# EAGLE design IUWASH_BOX (EAGLE 6.5.0)
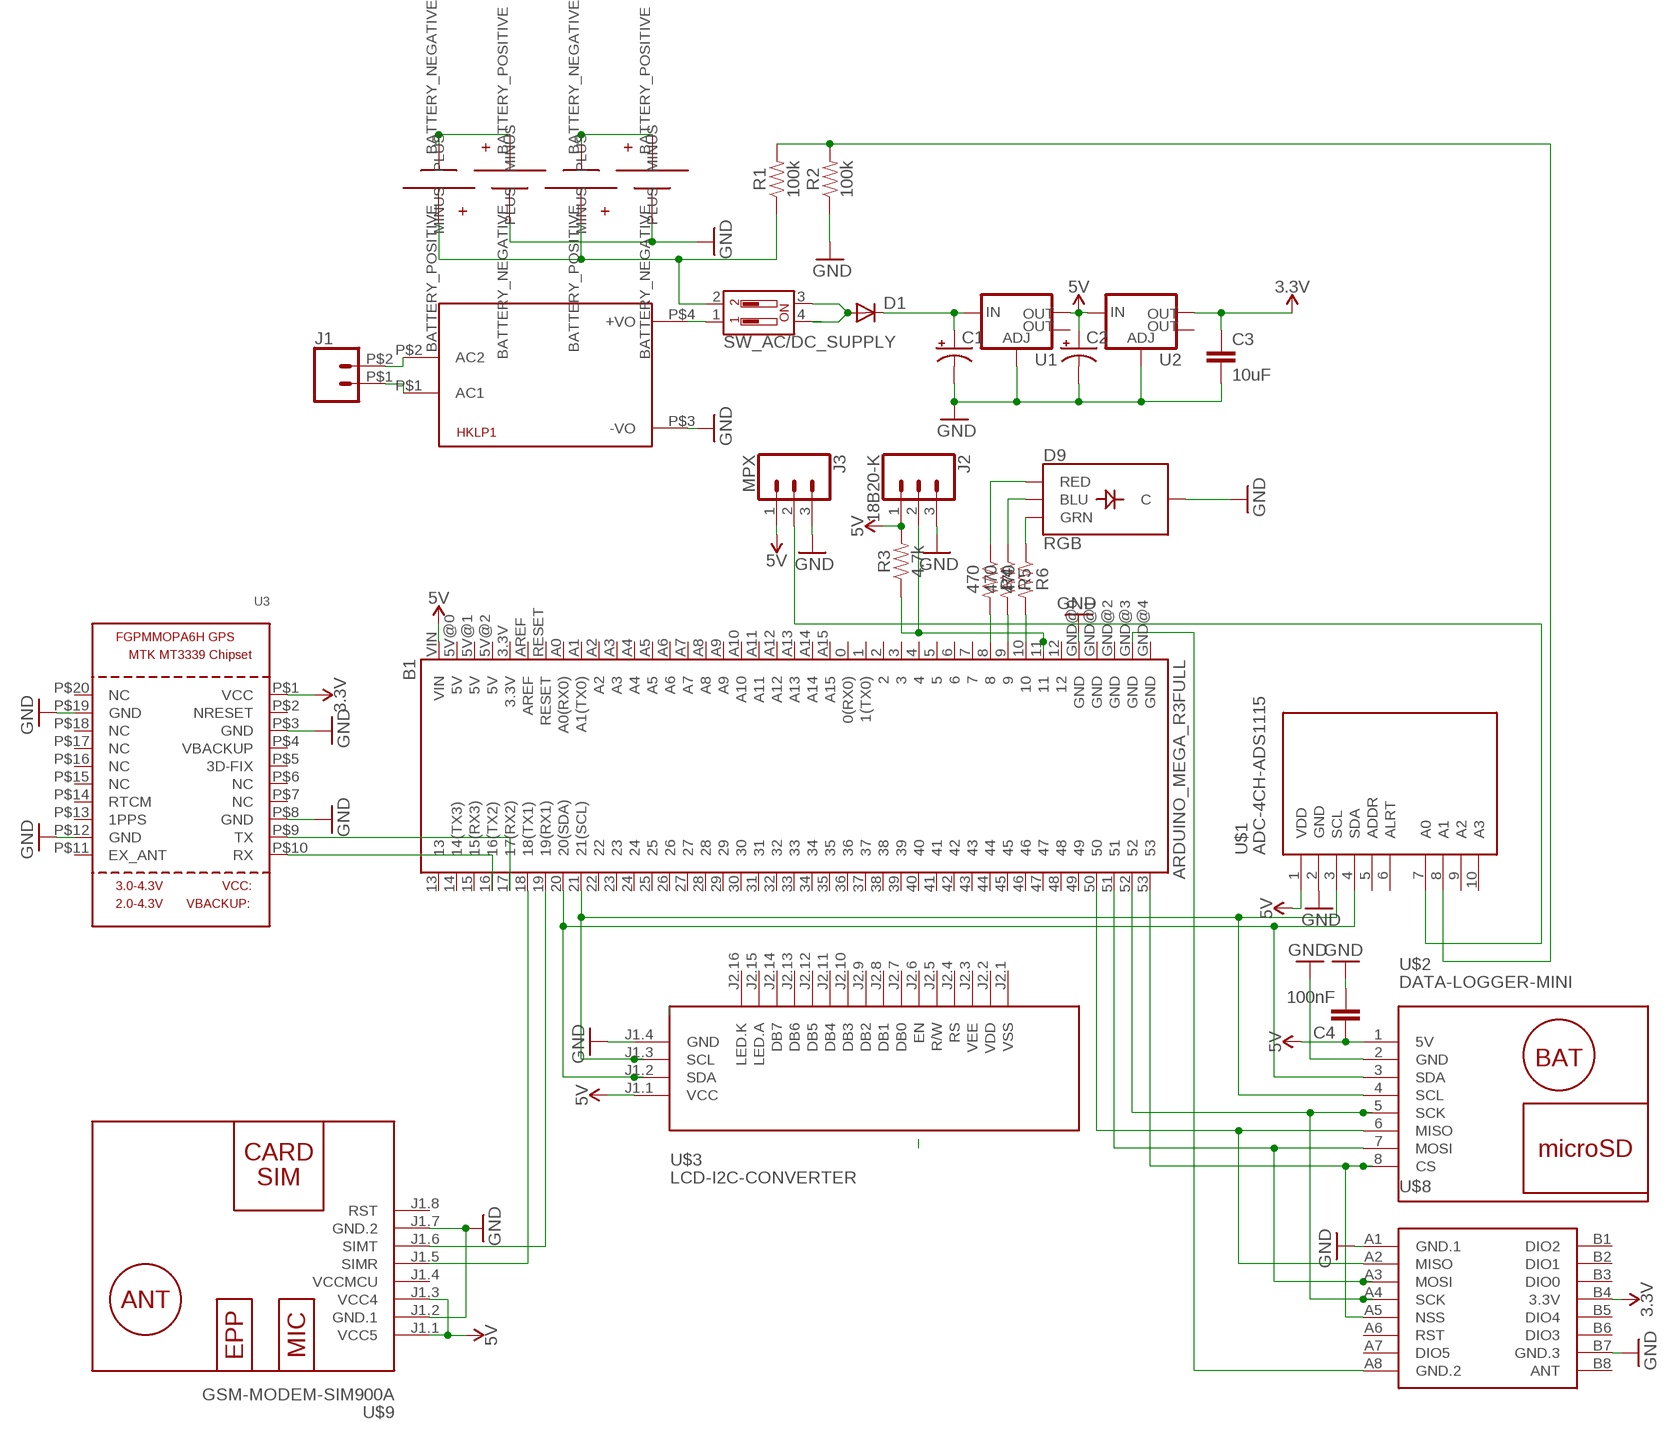
[diagram p0: schematic, sheet 1]

## Parts
B1  ARDUINO_MEGA_R3FULL  [ARDUINO_MEGA]
C1  CPOL-USE  [PANASONIC_E]
C2  CPOL-USE  [PANASONIC_E]
C3  10uF  10UF-0603-6.3V-20%  [0603]
C4  100nF  10UF-0603-6.3V-20%  [0603]
D1  DIODE-SOD106-W  [SOD106-W]
D9  RGB  LED-RGB-CCDIFFUSE  [LED-RGB-THRU]
HKLP1  HKLPM01  [HKLPM01]
J1  CONN_02PTH2  [1X02_BIG]
J2  18B20-K  CONN_03SCREW  [SCREWTERMINAL-3.5MM-3]
J3  MPX  CONN_03SCREW  [SCREWTERMINAL-3.5MM-3]
R1  100k  1KOHM-0603-1/10W-1%  [0603]
R2  100k  1KOHM-0603-1/10W-1%  [0603]
R3  4.7k  4.7KOHM-0603-1/10W-1%  [0603]
R4  470  1KOHM-0603-1/10W-1%  [0603]
R5  470  1KOHM-0603-1/10W-1%  [0603]
R6  470  1KOHM-0603-1/10W-1%  [0603]
SW_AC/DC_SUPPLY  DIP-02-PTH-100MIL  [DIPSWITCH-02-209-2LPST]
U1  V_REG_LM1117SOT223  [SOT223]
U2  V_REG_LM1117SOT223  [SOT223]
U3  GPS_FGPMMOPA6H  [FGPMMOPA6H]
U$1  ADC-4CH-ADS1115  [ADC-4CH-ADS1115]
U$2  DATA-LOGGER-MINI  [DATA-LOGGER-MINI]
U$3  LCD-I2C-CONVERTER  [LCD-I2C-CONVERTER]
U$4  SMT18650  [18650SMT]
U$5  SMT18650  [18650SMT]
U$6  SMT18650  [18650SMT]
U$7  SMT18650  [18650SMT]
U$8  WIRELESS-LORA-RFM95W#SMD  [WIRELESS-LORA-RFM95W#SMD]
U$9  GSM-MODEM-SIM900A  [GSM-MODEM-SIM900A]

## Nets
3.3V: C3.1 U2.2(OUT) U3.P$1(VCC) U$8.B4(3.3V)
5V: B1.VIN C2.+ C4.1 J2.1 J3.1 R3.2 U1.2(OUT) U2.3(IN) U$1.1(VDD) U$2.1(5V) U$3.J1.1(VCC) U$9.J1.1(VCC5) U$9.J1.3(VCC4)
GND: C4.2 HKLP1.P$3(-VO) J3.3 R2.1 U3.P$3(GND) U3.P$8(GND) U3.P$12(GND) U3.P$19(GND) U$2.2(GND) U$3.J1.4(GND) U$5.BATTERY_NEGATIVE(MINUS) U$7.BATTERY_NEGATIVE(MINUS) U$8.A1(GND.1) U$8.B7(GND.3) U$9.J1.2(GND.1) U$9.J1.7(GND.2)
N$1: C1.+ D1.C U1.3(IN)
N$2: B1.50 U$2.6(MISO) U$8.A2(MISO)
N$3: D1.A SW_AC/DC_SUPPLY.3 SW_AC/DC_SUPPLY.4
N$4: HKLP1.P$4(+VO) SW_AC/DC_SUPPLY.1
N$5: HKLP1.P$1(AC1) J1.P$1
N$6: HKLP1.P$2(AC2) J1.P$2
N$7: D9.3(GRN) R6.1
N$8: J3.2 U$1.7(A0)
N$9: R1.1 SW_AC/DC_SUPPLY.2 U$4.BATTERY_POSITIVE(PLUS) U$6.BATTERY_POSITIVE(PLUS)
N$10: U$4.BATTERY_NEGATIVE(MINUS) U$5.BATTERY_POSITIVE(PLUS)
N$11: U$6.BATTERY_NEGATIVE(MINUS) U$7.BATTERY_POSITIVE(PLUS)
N$12: R1.2 R2.2 U$1.8(A1)
N$13: B1.17(17(RX2)) U3.P$9(TX)
N$15: B1.52 U$2.5(SCK) U$8.A4(SCK)
N$16: B1.51 U$2.7(MOSI) U$8.A3(MOSI)
N$17: B1.16(16(TX2)) U3.P$10(RX)
N$18: B1.GND@3(GND) U$8.A8(GND.2)
N$19: B1.19(19(RX1)) U$9.J1.6(SIMT)
N$20: B1.20(20(SDA)) U$1.4(SDA) U$2.3(SDA) U$3.J1.2(SDA)
N$21: B1.21(21(SCL)) U$1.3(SCL) U$2.4(SCL) U$3.J1.3(SCL)
N$22: B1.53 U$2.8(CS) U$8.A5(NSS)
N$23: B1.18(18(TX1)) U$9.J1.5(SIMR)
N$31: B1.8 R4.2
N$32: B1.11 J2.2 R3.1
N$33: B1.9 R5.2
N$34: D9.4(BLU) R5.1
N$35: D9.1(RED) R4.1
N$36: B1.10 R6.2
N$56: B1.GND@0(GND) C1.- C2.- C3.2 D9.2(C) J2.3 U1.1(ADJ) U2.1(ADJ) U$1.2(GND) ; supply symbol labelled GND
Unconnected: B1.0(0(RX0)) B1.1(1(TX0)) B1.2 B1.3 B1.3.3V B1.4 B1.5 B1.5V@0(5V) B1.5V@1(5V) B1.5V@2(5V) B1.6 B1.7 B1.12 B1.13 B1.14(14(TX3)) B1.15(15(RX3)) B1.22 B1.23 B1.24 B1.25 B1.26 B1.27 B1.28 B1.29 B1.30 B1.31 B1.32 B1.33 B1.34 B1.35 B1.36 B1.37 B1.38 B1.39 B1.40 B1.41 B1.42 B1.43 B1.44 B1.45 B1.46 B1.47 B1.48 B1.49 B1.A0(A0(RX0)) B1.A1(A1(TX0)) B1.A2 B1.A3 B1.A4 B1.A5 B1.A6 B1.A7 B1.A8 B1.A9 B1.A10 B1.A11 B1.A12 B1.A13 B1.A14 B1.A15 B1.AREF B1.GND@1(GND) B1.GND@2(GND) B1.GND@4(GND) B1.RESET U1.4(OUT) U2.4(OUT) U3.P$2(NRESET) U3.P$4(VBACKUP) U3.P$5(3D-FIX) U3.P$6(NC) U3.P$7(NC) U3.P$11(EX_ANT) U3.P$13(1PPS) U3.P$14(RTCM) U3.P$15(NC) U3.P$16(NC) U3.P$17(NC) U3.P$18(NC) U3.P$20(NC) U$1.5(ADDR) U$1.6(ALRT) U$1.9(A2) U$1.10(A3) U$3.J2.1(VSS) U$3.J2.2(VDD) U$3.J2.3(VEE) U$3.J2.4(RS) U$3.J2.5(R/W) U$3.J2.6(EN) U$3.J2.7(DB0) U$3.J2.8(DB1) U$3.J2.9(DB2) U$3.J2.10(DB3) U$3.J2.11(DB4) U$3.J2.12(DB5) U$3.J2.13(DB6) U$3.J2.14(DB7) U$3.J2.15(LED.A) U$3.J2.16(LED.K) U$8.A6(RST) U$8.A7(DIO5) U$8.B1(DIO2) U$8.B2(DIO1) U$8.B3(DIO0) U$8.B5(DIO4) U$8.B6(DIO3) U$8.B8(ANT) U$9.J1.8(RST)

## Power pins joined to a net without a drawn wire
VCCMCU: U$9.J1.4(VCCMCU)

## Library data of the parts
B1 = SparkFun-Boards:ARDUINO_MEGA_R3: Arduino Mega R3 ATmega2560 R3 compatible footprint. SparkFun Products: Arduino Mega 2560 R3 <https://www.sparkfun.com/products/11061>
C1 C2 = adafruit:CPOL-US: POLARIZED CAPACITOR, American symbol
C3 = SparkFun-Capacitors:10UF: 10.0µF ceramic capacitors A capacitor is a passive two-terminal electrical component used to store electrical energy temporarily in an electric field.; PROD_ID: CAP-11015
C4 = SparkFun-Capacitors:10UF: 10.0µF ceramic capacitors A capacitor is a passive two-terminal electrical component used to store electrical energy temporarily in an electric field.; PROD_ID: CAP-11015; VALUE: 10uF
D1 = diode:DIODE-: DIODE
D9 = SparkFun-LED:LED-RGB-CC: LED-RGB Common Cathode Packages: LED RGB-THRU LED_PIRANHA_5MM SparkFun Products: RGB Diffused Common Cathode- Diffuse <[https://www.sparkfun.com/products/9264]> RGB Diffused Common Cathode - Clear <[https://www.sparkfun.com/products/105]> LED-RGB 5mm Square (Piranha) <[https://www.sparkfun.com/products/11679]>; PROD_ID: DIO-09434; VALUE: DIFFUSE
HKLP1 = HLKPM01EaglesLib:HKLPM01
J1 = SparkFun-Connectors:CONN_02: Multi connection point. Often used as Generic Header-pin footprint for 0.1 inch spaced/style header connections On any of the 0.1 inch spaced packages, you can populate with these: Break Away Headers - Straight <https://www.sparkfun.com/products/116> (PRT-00116) Break Away Male Headers - Right Angle <https://www.sparkfun.com/products/553> (PRT-00553) Female Headers <https://www.sparkfun.com/products/115> (PRT-00115) Break Away Headers - Machine Pin <https://www.sparkfun.com/products/117> (PRT-00117) Break Away Female Headers - Swiss Machine Pin <https://www.sparkfun.com/products/743> (PRT-00743) For SCREWTERMINALS and SPRING TERMINALS visit here: Screw Terimnals on SparkFun.com <https://www.sparkfun.com/search/results?term=Screw+Terminals> (5mm/3.5mm/2.54mm spacing) This device is also useful as a general connection point to wire up your design to another part of your project. Our various solder wires solder well into these plated through hole pads. Hook-Up Wire - Assortment (Stranded, 22 AWG) <https://www.sparkfun.com/products/11375> (PRT-11375) Hook-Up Wire - Assortment (Solid Core, 22 AWG) <https://www.sparkfun.com/products/11367> (PRT-11367) View the entire wire category on our website here <https://www.sparkfun.com/categories/141> Special notes: Molex polarized connector foot print use with: PRT-08233 with associated crimp pins and housings. 2.54_SCREWTERM for use with PRT-10571. 3.5mm Screw Terminal footprints for PRT-08084 5mm Screw Terminal footprints for use with PRT-08432
J2 J3 = SparkFun-Connectors:CONN_03: Multi connection point. Often used as Generic Header-pin footprint for 0.1 inch spaced/style header connections On any of the 0.1 inch spaced packages, you can populate with these: Break Away Headers - Straight <https://www.sparkfun.com/products/116> (PRT-00116) Break Away Male Headers - Right Angle <https://www.sparkfun.com/products/553> (PRT-00553) Female Headers <https://www.sparkfun.com/products/115> (PRT-00115) Break Away Headers - Machine Pin <https://www.sparkfun.com/products/117> (PRT-00117) Break Away Female Headers - Swiss Machine Pin <https://www.sparkfun.com/products/743> (PRT-00743) Stackable Header - 3 Pin (Female, 0.1") <https://www.sparkfun.com/products/13875> (PRT-13875) For SCREWTERMINALS and SPRING TERMINALS visit here: Screw Terimnals on SparkFun.com <https://www.sparkfun.com/search/results?term=Screw+Terminals> (5mm/3.5mm/2.54mm spacing) This device is also useful as a general connection point to wire up your design to another part of your project. Our various solder wires solder well into these plated through hole pads. Hook-Up Wire - Assortment (Stranded, 22 AWG) <https://www.sparkfun.com/products/11375> (PRT-11375) Hook-Up Wire - Assortment (Solid Core, 22 AWG) <https://www.sparkfun.com/products/11367> (PRT-11367) View the entire wire category on our website here <https://www.sparkfun.com/categories/141> Special notes: Molex polarized connector foot print use with SKU : PRT-08232 with associated crimp pins and housings.; PROD_ID: CONN-08288; SF_ID: PRT-08235
R1 R2 R4-R6 = SparkFun-Resistors:1KOHM: 1kΩ resistor A resistor is a passive two-terminal electrical component that implements electrical resistance as a circuit element. Resistors act to reduce current flow, and, at the same time, act to lower voltage levels within circuits. - Wikipedia; PROD_ID: RES-07856; VALUE: 1k
R3 = SparkFun-Resistors:4.7KOHM: 4.7kΩ resistor A resistor is a passive two-terminal electrical component that implements electrical resistance as a circuit element. Resistors act to reduce current flow, and, at the same time, act to lower voltage levels within circuits. - Wikipedia; PROD_ID: RES-07857
SW_AC/DC_SUPPLY = SparkFun-Switches:DIP-02: 2-Position DIP Switch 2-circuit DIP (dual inline package) switch. Commonly used to physcially set a circuit's behavior. Variants PTH-100MIL - Through-hole, 0.1"-Pitch Used on SparkFun Stepoko <https://www.sparkfun.com/products/13899> (ROB-13899) SMD-50MIL-JWING - SMD (J-Wing Pads), 0.05"-Pitch Prototype Part SMD-50MIL - SMD, 0.05"-Pitch Used on SparkFun Battery Babysitter <https://www.sparkfun.com/products/13777> (PRT-13777); PROD_ID: SWCH-12532
U1 U2 = SparkFun-IC-Power:V_REG_LM1117: Voltage Regulator LM1117 Standard adjustable voltage regulator but in SMD form. Spark Fun Electronics SKU : COM-00595; PROD_ID: VREG-08170
U3 = adafruit:GPS_FGPMMOPA6H: GPS Module - MTK MT3339 Chipset, -165dBm sensitivity, 22 channels, 10Hz, auto-select external antenna options
U$1 = diy-modules:ADC-4CH-ADS1115: 4 Channel 16-Bit Analog-to-Digital Converter based on ADS1115 chip Arduino ADS1115 Getting Started Tutorial is available here: http://henrysbench.capnfatz.com/henrys-bench/arduino-voltage-measurements/arduino-ads1115-module-getting-started-tutorial/ ADS1115 datasheet is available here: http://www.ti.com/lit/ds/symlink/ads1115.pdf Click here to find device on ebay.com <http://www.ebay.com/sch/ads1115+module>
U$2 = diy-modules:DATA-LOGGER-MINI: Mini Data Logger with microSD card and battery powered RTC based on DS1307 chip Arduino library for DS1307 and description are available here: https://www.pjrc.com/teensy/td_libs_DS1307RTC.html Tutorial how to use SD card with Arduino: https://www.arduino.cc/en/reference/SD Click here to find device on ebay.com <http://www.ebay.com/sch/mini+data+logger+arduino>
U$3 = diy-modules:LCD-I2C-CONVERTER: I2C Bus to 4-Bit Parallel LCD Interface with LED backlight driver
U$4-U$7 = SMT18650:SMT18650
U$8 = diy-modules:WIRELESS-LORA-RFM95W: 868/915 MHz LoRa Radio Transceiver Module based on SX1276 chip Click here to find device on ebay.com <http://www.ebay.com/sch/RFM95W+transceiver>
U$9 = diy-modules:GSM-MODEM-SIM900A: GSM Mini Module based on SIM900A Schematic available here: http://www.electrodragon.com/w/SIM900_(SIM900A)_Mini_DEV_Board

## Board
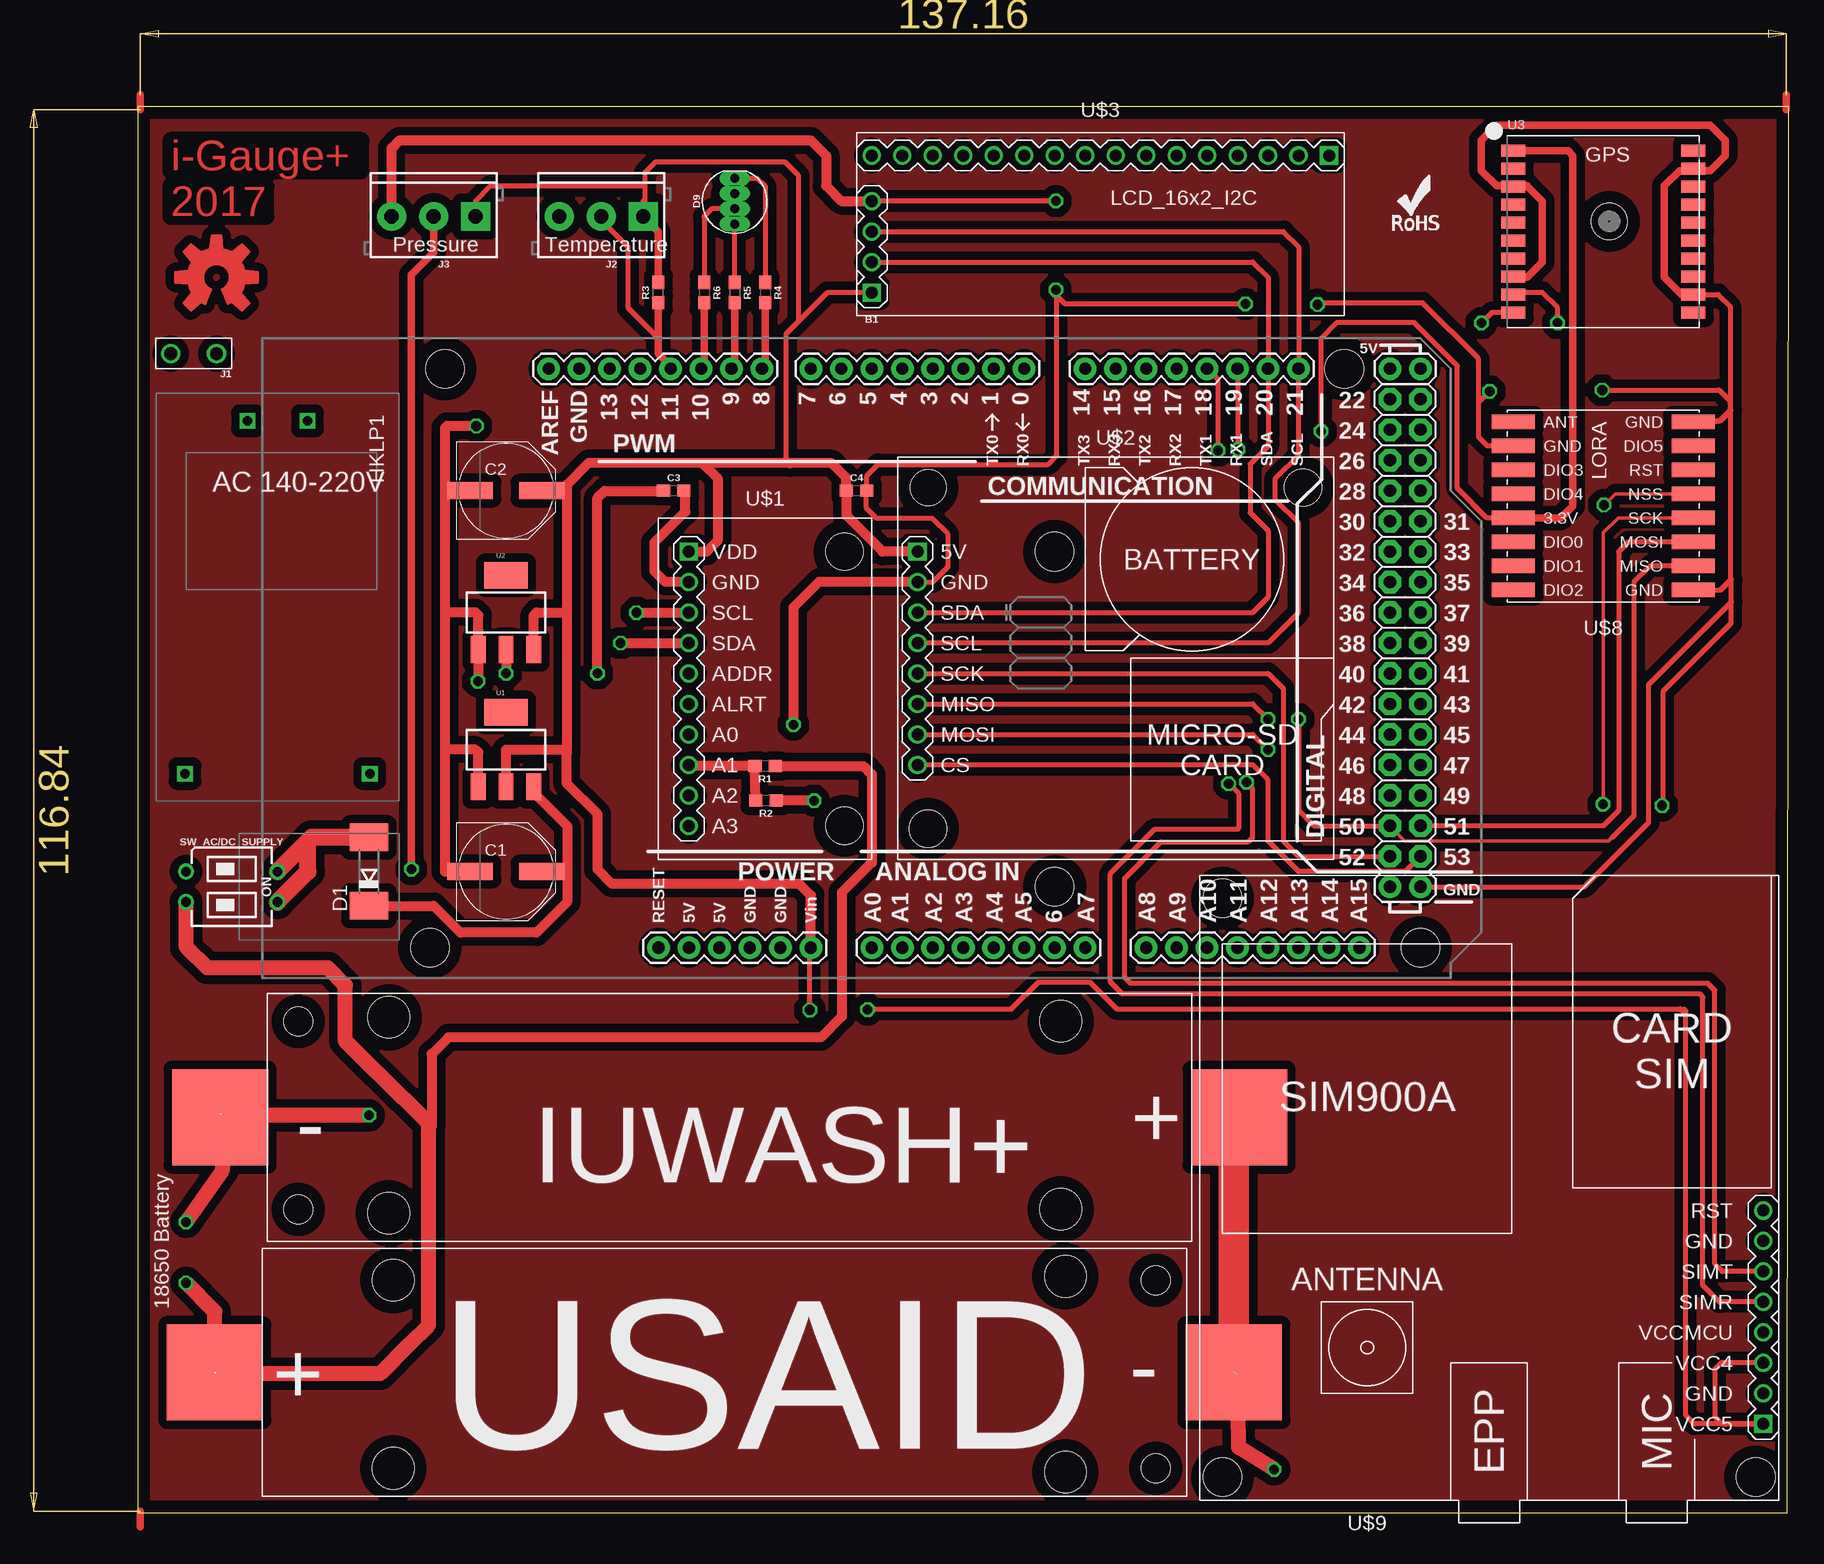
[diagram p1: board, top side]
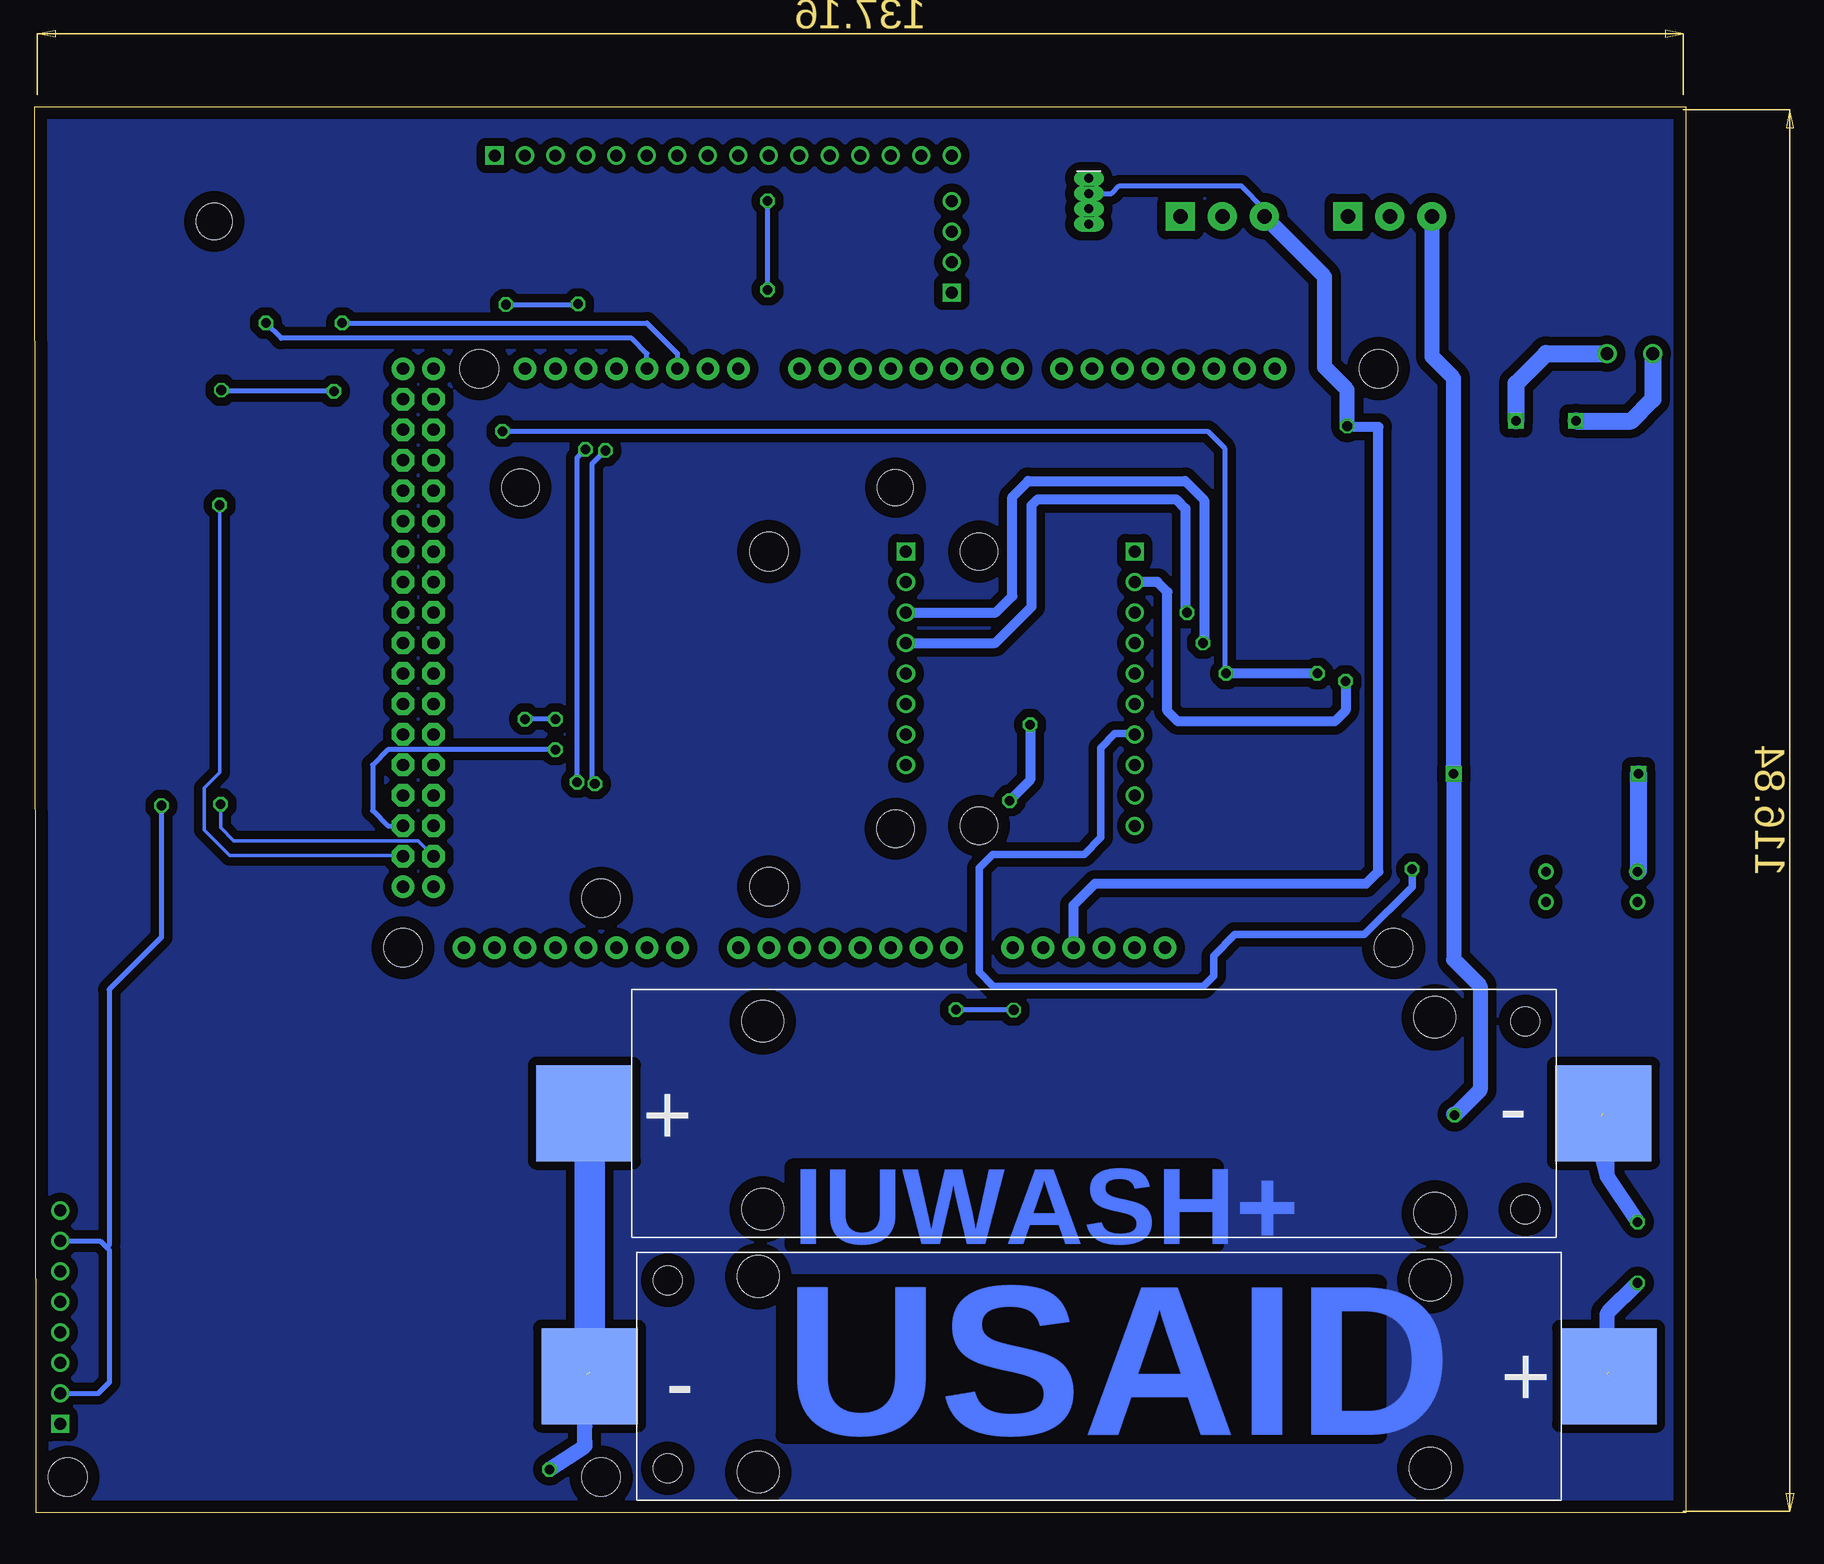
[diagram p2: board, bottom side, seen from below]

Size 137.56 x 117.21 mm. Coordinates in mm from the lower left corner, seen from the top.
Outline: 0,0 137.46,0 137.56,117.21 0,117.21 0,0
Copper layers (1*16): Top 0.035mm / dielectric 1.5mm / Bottom 0.035mm
Design rules "default *": minimum track width 10mil, minimum drill 24mil, track to track 28mil, track to pad 28mil, pad to pad 28mil, via to via 28mil, smd to smd 28mil, copper to edge 40mil, drill to drill 8mil, minimum pad ring 10mil, minimum via ring 8mil, stop-mask expansion 4mil, vias tented up to drill 0mil, thermal gap 10mil

### Footprints (pad centres in the part's own frame; a part is rotated, then mirrored left to right if it is on the bottom)
ARDUINO_MEGA = drill 1.016 pad 1.88: 0 13.97,24.13; 1 11.43,24.13; 2 8.89,24.13; 3 6.35,24.13; 3.3V -13.97,-24.13; 4 3.81,24.13; 5 1.27,24.13; 5V@0 -11.43,-24.13; 5V@1 44.45,24.13; 5V@2 46.99,24.13; 6 -1.27,24.13; 7 -3.81,24.13; 8 -7.874,24.13; 9 -10.414,24.13; 10 -12.954,24.13; 11 -15.494,24.13; 12 -18.034,24.13; 13 -20.574,24.13; 14 19.05,24.13; 15 21.59,24.13; 16 24.13,24.13; 17 26.67,24.13; 18 29.21,24.13; 19 31.75,24.13; 20 34.29,24.13; 21 36.83,24.13; A0 1.27,-24.13; A1 3.81,-24.13; A2 6.35,-24.13; A3 8.89,-24.13; A4 11.43,-24.13; A5 13.97,-24.13; A6 16.51,-24.13; A7 19.05,-24.13; A8 24.13,-24.13; A9 26.67,-24.13; A10 29.21,-24.13; A11 31.75,-24.13; A12 34.29,-24.13; A13 36.83,-24.13; A14 39.37,-24.13; A15 41.91,-24.13; AREF -25.654,24.13; GND@0 -8.89,-24.13; GND@1 -6.35,-24.13; GND@2 44.45,-19.05; GND@3 46.99,-19.05; GND@4 -23.114,24.13; RESET -16.51,-24.13; VIN -3.81,-24.13 | drill 1.016 pad 1.88 octagon: 22 44.45,21.59; 23 46.99,21.59; 24 44.45,19.05; 25 46.99,19.05; 26 44.45,16.51; 27 46.99,16.51; 28 44.45,13.97; 29 46.99,13.97; 30 44.45,11.43; 31 46.99,11.43; 32 44.45,8.89; 33 46.99,8.89; 34 44.45,6.35; 35 46.99,6.35; 36 44.45,3.81; 37 46.99,3.81; 38 44.45,1.27; 39 46.99,1.27; 40 44.45,-1.27; 41 46.99,-1.27; 42 44.45,-3.81; 43 46.99,-3.81; 44 44.45,-6.35; 45 46.99,-6.35; 46 44.45,-8.89; 47 46.99,-8.89; 48 44.45,-11.43; 49 46.99,-11.43; 50 44.45,-13.97; 51 46.99,-13.97; 52 44.45,-16.51; 53 46.99,-16.51 | hole 3.2: -34.29,24.13; -35.56,-24.13; 16.51,8.89; 16.51,-19.05; 40.64,24.13; 46.99,-24.13
PANASONIC_E = smd 3.8 x 1.4: + 3,0; - -3,0
0603 = smd 1.1 x 1: 1 -0.85,0; 2 0.85,0
SOD106-W = smd 2.3 x 3.2: A 2.85,0; C -2.85,0
LED-RGB-THRU = drill 0.762 pad 0.889 long: 1 1.905,0; 2 0.635,0; 3 -0.635,0; 4 -1.905,0
HKLPM01 = drill 0.8 square: P$1 -14.7,2.5; P$2 -14.7,-2.5; P$3 14.7,7.7; P$4 14.7,-7.7
1X02_BIG = drill 1.067: P$1 0,0; P$2 3.81,0
SCREWTERMINAL-3.5MM-3 = drill 1.2 pad 2.413 square: 1 0,0 | drill 1.2 pad 2.413: 2 3.5,0; 3 7,0
DIPSWITCH-02-209-2LPST = drill 0.8: 1 -1.27,-3.81; 2 1.27,-3.81; 3 1.27,3.81; 4 -1.27,3.81
SOT223 = smd 1.219 x 2.235: 1 -2.311,-3.099; 2 0,-3.099; 3 2.311,-3.099 | smd 3.6 x 2.2: 4 0,3.099
FGPMMOPA6H = smd 2 x 1: P$1 -7.5,6.75; P$2 -7.5,5.25; P$3 -7.5,3.75; P$4 -7.5,2.25; P$5 -7.5,0.75; P$6 -7.5,-0.75; P$7 -7.5,-2.25; P$8 -7.5,-3.75; P$9 -7.5,-5.25; P$10 -7.5,-6.75; P$11 7.5,-6.75; P$12 7.5,-5.25; P$13 7.5,-3.75; P$14 7.5,-2.25; P$15 7.5,-0.75; P$16 7.5,0.75; P$17 7.5,2.25; P$18 7.5,3.75; P$19 7.5,5.25; P$20 7.5,6.75 | hole 3: 0.5,0.85
ADC-4CH-ADS1115 = drill 1 square: 1 -6.35,11.43 | drill 1: 2 -6.35,8.89; 3 -6.35,6.35; 4 -6.35,3.81; 5 -6.35,1.27; 6 -6.35,-1.27; 7 -6.35,-3.81; 8 -6.35,-6.35; 9 -6.35,-8.89; 10 -6.35,-11.43 | hole 3.1: 6.604,11.43; 6.604,-11.43
DATA-LOGGER-MINI = drill 1 square: 1 -16.51,8.89 | drill 1: 2 -16.51,6.35; 3 -16.51,3.81; 4 -16.51,1.27; 5 -16.51,-1.27; 6 -16.51,-3.81; 7 -16.51,-6.35; 8 -16.51,-8.89 | hole 3: -15.621,14.224 | hole 3.1: -15.621,-14.224; 15.621,14.224
LCD-I2C-CONVERTER = drill 1 square: J1.1 -19.05,-5.08; J2.1 19.05,6.35 | drill 1: J1.2 -19.05,-2.54; J1.3 -19.05,0; J1.4 -19.05,2.54; J2.2 16.51,6.35; J2.3 13.97,6.35; J2.4 11.43,6.35; J2.5 8.89,6.35; J2.6 6.35,6.35; J2.7 3.81,6.35; J2.8 1.27,6.35; J2.9 -1.27,6.35; J2.10 -3.81,6.35; J2.11 -6.35,6.35; J2.12 -8.89,6.35; J2.13 -11.43,6.35; J2.14 -13.97,6.35; J2.15 -16.51,6.35; J2.16 -19.05,6.35
18650SMT = smd 8 x 8: BATTERY_NEGATIVE 80.98,10.32; BATTERY_POSITIVE -3.95,10.32 | hole 3.45: 66.925,18.325; 10.925,2.325 | hole 2.39: 74.455,2.325
WIRELESS-LORA-RFM95W#SMD = smd 3.6 x 1.2: A1 -7.5,7; A2 -7.5,5; A3 -7.5,3; A4 -7.5,1; A5 -7.5,-1; A6 -7.5,-3; A7 -7.5,-5; A8 -7.5,-7; B1 7.5,7; B2 7.5,5; B3 7.5,3; B4 7.5,1; B5 7.5,-1; B6 7.5,-3; B7 7.5,-5; B8 7.5,-7
GSM-MODEM-SIM900A = drill 1 square: J1.1 -22.86,20.32 | drill 1: J1.2 -22.86,17.78; J1.3 -22.86,15.24; J1.4 -22.86,12.7; J1.5 -22.86,10.16; J1.6 -22.86,7.62; J1.7 -22.86,5.08; J1.8 -22.86,2.54 | hole 3.2: -22.225,24.765; 22.225,24.765; 22.225,-23.495

### Placement (x,y rotation side)
B1  59.89,71.24 0 top
C1  30.68,53.46 0 top
C2  30.68,85.21 0 top
C3  44.65,85.21 0 top
C4  59.89,85.21 0 top
D1  19.25,53.46 90 top
D9  49.73,109.34 90 top
HKLP1  11.63,76.32 270 top
J1  6.55,96.64 180 top
J2  42.11,108.07 180 top
J3  28.14,108.07 180 top
R1  52.28,62.25 180 top
R2  52.34,59.37 180 top
R3  43.38,101.72 90 top
R4  52.27,101.72 270 top
R5  49.73,101.72 270 top
R6  47.19,101.72 270 top
SW_AC/DC_SUPPLY  7.82,52.19 270 top
U1  30.68,63.62 0 top
U2  30.68,75.05 0 top
U3  122.12,106.8 0 top
U$1  52.27,68.7 0 top
U$2  81.48,71.24 0 top
U$3  80.21,106.8 0 top
U$4  10.36,21.71 180 bottom
U$5  87.83,22.98 0 bottom
U$6  10.36,1.39 0 top
U$7  87.83,43.3 180 top
U$8  122.12,83.94 180 top
U$9  112.6,27.74 180 top
U$10  [OSHW-LOGO-L_COPPER]  6.55,102.99 0 top
U$11  [ROHS_LOGO_0.18_IN]  104.34,106.8 0 top
U$12  [ROHS_LOGO_0.18_IN]  104.34,106.8 0 top

### Tracks (layer width: path | path; a pad name or v marks a point on that pad's centre or on a via)
3.3V  (via drill 0.8)
  Top 0.406: U$8.B4 112.42,82.94 109.96,85.41 109.96,95.62 106.37,99.2 99.88,99.2 98.57,97.9 98.57,90.19 v98.6,90.17
  Top 0.61: U3.P$1 119.18,113.55 119.58,113.15 119.58,83.94 118.58,82.94 U$8.B4
  Top 0.813: U2.2 v30.68,69.97 | v38.3,69.97 38.3,84.6 38.89,85.2 43.78,85.2 C3.1
  Bottom 0.406: v98.6,90.17 39.84,90.17 38.42,88.75 38.42,70.09 v38.3,69.97
  Bottom 0.813: v30.68,69.97 v38.3,69.97
5V  (via drill 0.8)
  Top 0.406: J3.1 28.14,109.34 29.41,110.61 42.17,110.61 42.26,110.7 | 42.11,109.34 J2.1 42.26,108.22 42.26,110.7 | 42.26,110.7 42.26,111.74 43.13,112.61 53.94,112.61 55.05,111.5 55.05,99.31 | 55.05,99.31 54.12,98.38 54,98.27 54,87.83 54.33,87.5 | U$3.J1.1 57.46,101.72 55.05,99.31 | U$9.J1.3 131.93,12.5 131.41,11.98 131.41,8 131.99,7.42 U$9.J1.1 129.71,7.42 128.99,8.13 128.99,41.56 | 128.99,41.56 128.99,41.84 128.84,41.99 | v60.81,41.96 60.85,41.99 72.8,41.99 75.05,44.25 79.33,44.25 81.55,42.02 128.53,42.02 128.99,41.56 | v55.99,41.92 55.99,47.02 B1.VIN
  Top 0.61: R3.2 43.38,106.8 J2.1
  Top 0.813: U1.2 30.68,63.62 35.47,63.62 | 35.47,63.62 35.76,63.62 35.76,75.05 | 35.76,75.05 35.76,85.21 | 35.76,85.21 C2.+ | U2.3 32.99,74.82 33.22,75.05 35.76,75.05 | B1.VIN 56.08,51.48 55.11,52.44 39.51,52.44 38.31,53.64 38.31,58.24 35.76,60.79 35.76,63.34 35.47,63.62 | 35.76,85.21 35.76,85.72 37.59,87.55 47,87.55 47.12,87.43 | 47.12,87.43 48.31,86.25 48.31,81.04 47.4,80.13 U$1.1 | U$2.1 62.06,80.13 59.06,83.13 59.06,85.19 C4.1 59.04,86.29 57.83,87.5 54.33,87.5 47.19,87.5 47.12,87.43
  Bottom 0.406: v60.81,41.96 56.02,41.96 v55.99,41.92
GND  (via drill 0.8)  (1 unrouted)
  Top 0.406: U$2.2 66.24,77.59 67.51,78.86 67.51,81.59 66.21,82.89 61.58,82.89 60.7,83.77 60.7,85.18 C4.2 60.74,86.46 61.66,87.39 75.85,87.39 76.58,88.12 76.58,101.46 | 76.58,101.46 76.58,101.88 v76.5,101.96 | v76.5,109.35 U$3.J1.4 | U$8.B7 112.47,88.94 111.73,89.69 111.73,92.58 | 111.73,92.58 v112.65,93.5 | v122.03,93.59 131.77,93.59 132.69,92.67 132.69,92.43 | 132.69,92.43 132.69,92.12 | 132.69,92.12 132.69,91.94 131.73,90.97 129.65,90.97 | U$8.A1 131.91,76.94 | 131.91,76.94 132.74,77.77 132.74,92.08 132.69,92.12 | U3.P$12 131.7,101.55 132.68,100.57 132.68,92.44 132.69,92.43 | 111.73,92.58 111.73,96.22 107.09,100.86 98.45,100.86 v98.31,100.72 | v92.29,100.77 77.27,100.77 76.58,101.46 | 131.91,76.94 131.91,76.97 132.76,77.81 132.76,74.14 127.09,68.47 127.09,59.03 v127.02,58.96
  Top 0.61: U3.P$3 115.83,110.55 | 115.83,110.55 117.04,109.34 117.04,104.26 115.77,102.99 114.68,102.99 U3.P$8 | U3.P$12 128.64,101.55 127.2,102.99 127.2,110.61 128.47,111.88 129.45,111.88 U3.P$19 129.79,111.88 131.01,111.88 132.28,113.15 132.28,114.42 131.01,115.69 113.23,115.69 111.96,114.42 111.96,111.88 113.23,110.61 115.77,110.61 115.83,110.55
  Top 0.813: J3.3 21.14,113.77 21.79,114.42 56.08,114.42 57.35,113.15 57.35,110.61 58.62,109.34 U$3.J1.4 | U$2.2 56.75,77.59 54.62,75.47 v54.62,65.7 | v56.34,59.38 R2.1
  Top 1.27: v19.25,33.14 7.01,33.14 | 7.01,33.14 U$7.BATTERY_NEGATIVE | 7.01,33.14 7.01,28.52 v4.01,24.25
  Bottom 0.406: v76.5,101.96 v76.5,109.35 | v112.65,93.5 121.94,93.5 v122.03,93.59 | v98.31,100.72 92.33,100.72 v92.29,100.77 | U$9.J1.7 132.12,22.66 131.58,22.12 | 131.58,22.12 131.36,21.9 131.36,10.9 132.31,9.94 135.44,9.94 U$9.J1.2 | v127.02,58.96 127.02,47.98 131.38,43.63 131.38,22.33 131.58,22.12
  Bottom 0.813: v54.62,65.7 54.62,61.1 v56.34,59.38
  Bottom 1.27: 19.33,33.22 v19.25,33.14 17.14,35.26 17.14,43.93 19.33,46.12 HKLP1.P$3 19.33,94.57 21.14,96.38 J3.3 | 7.01,33.14 7.01,29.79 6.55,28.06 | v4.01,24.25 6.55,28.06 | 6.55,28.06 6.55,32.68 U$7.BATTERY_NEGATIVE
N$1
  Top 0.813: D1.C 24.64,50.61 26.87,48.38 33.22,48.38 35.76,50.92 35.76,53.46 | U1.3 32.99,60.04 35.76,57.27 35.76,53.46 | C1.+ 35.76,53.46
N$2  (via drill 0.8)
  Top 0.305: 122.87,56.31 122.69,56.13 122.69,56.16 | 122.69,56.21 122.69,56.16 | 122.69,56.16 122.55,56.02 105.59,56.02 B1.50
  Top 0.406: U$2.6 92.91,67.43 v94.18,66.16 | v96.72,66.16 96.72,58.54 97.99,57.27 B1.50 | U$8.A2 126.01,78.94 124.66,77.59 124.66,58.1 122.87,56.31
  Bottom 0.406: v94.18,66.16 v96.72,66.16
N$3
  Top 1.422: D1.A 14.48,56.31 14.17,56 | 14.17,56 SW_AC/DC_SUPPLY.4 | SW_AC/DC_SUPPLY.3 14.17,53.46 14.17,56
N$4
  Bottom 1.422: HKLP1.P$4 3.93,53.54 SW_AC/DC_SUPPLY.1
N$5
  Bottom 1.422: HKLP1.P$1 14.13,94.14 11.63,96.64 J1.P$1
N$6
  Bottom 1.422: J1.P$2 2.74,92.83 4.55,91.02 HKLP1.P$2
N$7
  Top 0.406: D9.3 47.83,108.71 47.19,108.07 R6.1
N$8  (via drill 0.8)
  Top 0.61: J3.2 24.64,105.08 22.79,103.23 v22.79,53.68 v22.79,53.67
  Bottom 0.61: v22.79,53.67 22.79,52.18 26.77,48.21 37.56,48.21 39.34,46.42 39.34,44.76 40.2,43.9 57.68,43.9 58.87,45.1 58.87,53.77 57.75,54.9 50.14,54.9 48.74,56.29 48.74,63.78 47.55,64.97 45.99,64.97 U$1.7
N$9  (via drill 0.8)  (2 unrouted)
  Top 0.813: R1.1 60.47,62.25 61.16,61.56 61.16,54.21 58.67,51.73 58.67,41.38 56.94,39.65 25.9,39.65 24.51,38.27 24.49,38.27 24.49,32.14 24.23,31.89
  Top 1.27: 22.66,14.07 20.18,11.6 6.61,11.6 U$4.BATTERY_POSITIVE 6.41,16.77 v4.01,19.17 | 22.66,14.07 | 22.66,14.07 24.23,15.64 24.23,31.89 24.23,32.46 20.09,36.6 20.03,36.6 17.3,39.33 17.3,43.99 15.86,45.43 5.76,45.43 4.04,47.15 4.04,50.9 SW_AC/DC_SUPPLY.2
  Bottom 1.27: 6.53,11.6 6.53,16.66 v4.01,19.17
N$10
  Bottom 2.54: U$4.BATTERY_NEGATIVE 91.34,32.86 U$5.BATTERY_POSITIVE
N$11  (via drill 0.8)  (1 unrouted)
  Top 1.27: v94.68,3.62 91.74,5.47 91.64,11.55
  Top 2.54: U$6.BATTERY_NEGATIVE 91.34,32.54 U$7.BATTERY_POSITIVE
  Bottom 1.27: 91.78,11.69 91.78,6.5 91.74,5.56 | v94.68,3.62 91.74,5.56 | 91.74,5.56 91.64,11.55
N$12
  Top 0.813: R2.2 R1.2 46.03,62.25 U$1.8
N$13  (via drill 0.8)
  Top 0.406: v118.31,99.18 118.31,100.45 117.04,101.72 114.79,101.72 U3.P$9
  Bottom 0.406: B1.17 86.56,96.64 87.83,97.91 117.04,97.91 v118.31,99.18
N$14
  pour Top: 0.2,115.69 1.47,116.96 136.09,116.96 137.36,115.69 137.36,1.39 136.09,0.12 2.74,0.12 1.47,0.12 0.2,1.39
N$15  (via drill 0.8)
  Top 0.305: U$8.A4 123.36,82.94 122.11,81.7 122.11,59.1 v122.09,59.09
  Top 0.406: U$2.5 94.18,69.97 95.45,68.7 95.45,56 96.72,54.73 B1.52
  Bottom 0.305: v122.09,59.09 122.09,57.13 120.99,56.03 105.64,56.03 B1.52
N$16  (via drill 0.8)
  Top 0.406: U$2.7 92.91,64.89 v94.18,63.62 | U$8.A3 124.2,80.94 123.39,80.13 123.39,58.54 122.12,57.27 B1.51
  Bottom 0.406: v94.18,63.62 108.15,63.62 109.42,62.35 109.42,58.54 108.15,57.27 B1.51
N$17  (via drill 0.8)
  Top 0.406: U3.P$10 112.83,100.05 v111.96,99.18
  Bottom 0.406: v111.96,99.18 86.56,99.18 84.02,96.64 B1.16
N$18
  Top 0.406: B1.GND@3 120.55,52.19 125.89,57.54 125.89,69.04 132.79,75.93 132.79,77.82 132.74,77.87 132.74,91.92 132.75,91.92 132.75,91.89 131.88,91.03 129.7,91.03 U$8.A8
N$19  (via drill 0.8)
  Top 0.406: U$9.J1.6 132.02,20.12 131.42,20.72 131.42,43.55 130.83,44.14 82.72,44.14 82.23,44.63 82.23,52.9 85.26,55.93 92.52,55.93 92.89,56.3 92.89,60.41 v92.37,60.92 | v91.69,88.65 91.69,95.32 B1.19
  Bottom 0.406: v92.37,60.92 92.37,87.97 v91.69,88.65
N$20  (via drill 0.8)
  Top 0.406: U$2.3 92.91,75.05 94.19,76.33 94.19,81.88 92.7,83.37 92.7,87.44 94.18,88.93 B1.20 94.18,102.99 92.91,104.26 U$3.J1.2
  Top 0.813: v40.22,72.51 U$1.4
  Bottom 0.813: U$2.3 57.47,75.05 56.11,76.41 56.11,84.69 54.79,86.02 41.72,86.02 40.12,84.41 40.12,72.62 v40.22,72.51
N$21  (via drill 0.8)
  Top 0.406: U$2.4 94.18,72.51 96.72,75.05 96.72,82.5 94.8,84.42 94.8,86.24 96.75,88.19 96.75,95.35 B1.21 96.72,105.53 95.45,106.8 U$3.J1.3
  Top 0.813: v41.54,75.05 U$1.3
  Bottom 0.813: U$2.4 57.53,72.51 54.74,75.31 54.5,75.54 54.5,83.99 53.99,84.51 42.46,84.51 41.69,83.74 41.69,75.2 v41.54,75.05
N$22  (via drill 0.8)
  Top 0.305: U$8.A5 123.09,84.94 v122.16,84.01
  Top 0.406: B1.53 105.61,53.46 96.72,53.46 94.18,56 94.18,61.08 92.91,62.35 U$2.8
  Bottom 0.305: v122.16,84.01 122.16,61.72 123.44,60.44 123.44,56.91 121.34,54.81 106.96,54.81 B1.53
N$23  (via drill 0.8)
  Top 0.406: U$9.J1.5 131.79,17.58 130.42,18.95 130.42,43 130.17,43.25 82.04,43.25 81.04,44.25 81.04,53.29 84.74,56.99 91.67,56.99 91.78,57.1 91.78,59.91 v90.91,60.78 | v90.02,88.55 90.02,94.45 B1.18
  Bottom 0.406: v90.91,60.78 90.91,60.92 91.13,61.15 91.13,87.45 v90.02,88.55
N$24
  pour Bottom: 0.2,115.69 1.47,116.96 136.09,116.96 137.36,115.69 137.36,1.39 136.09,0.12 1.47,0.12 0.2,1.39
N$25
  Top 0.61: 0.2,116.96 0.2,118.23
N$26
  Top 0.61: 137.36,116.96 137.36,118.23
N$27
  Top 0.61: 0.2,0.12 0.2,-1.15
N$31
  Top 0.61: R4.2 52.27,95.63 B1.8
N$32
  Top 0.406: J2.2 38.61,107.76 40.84,105.53 40.84,100.45 43.38,97.91
  Top 0.61: B1.11 44.4,95.63 43.38,96.64 43.38,97.91 R3.1
N$33
  Top 0.61: R5.2 49.73,95.63 B1.9
N$34
  Top 0.406: R5.1 D9.4
N$35
  Top 0.406: D9.1 51.63,111.25 52.27,110.61 R4.1
N$36
  Top 0.61: R6.2 47.19,95.63 B1.10
N$56  (via drill 0.8)
  Top 0.813: 28.37,60.04 U1.1 28.37,63.39 28.14,63.62 25.6,63.62 | C1.- 25.6,53.46 25.6,63.62 | U2.1 28.37,73.56 | 25.6,63.62 25.6,75.05 | 25.6,75.05 25.6,85.21 | U2.1 28.37,74.82 28.14,75.05 25.6,75.05 | C2.- 25.6,85.21 | 25.6,85.21 25.6,90.43 25.77,90.6 v28.2,90.6 | U2.1 28.37,69.35 v28.34,69.33 | U$1.2 43.95,77.59 43.06,78.48 43.06,80.91 45.62,83.46 45.62,85.1 C3.2
  Bottom 0.406: J2.3 35.11,108.69 37.03,110.61 47.19,110.61 47.83,109.98 D9.2
  Bottom 0.813: B1.GND@0 51,50.66 49.21,52.45 26.62,52.45 25.6,53.46 25.6,90.53 28.13,90.53 v28.2,90.6 | v28.34,69.33 28.34,66.89 29.25,65.98 42.31,65.98 43.19,66.86 43.19,76.76 44.02,77.59 U$1.2
  Bottom 1.27: v28.2,90.6 28.2,93.63 30.08,95.51 30.08,103.04 J2.3

### Text on the board
Top: i-Gauge+ | 2017
Bottom: IUWASH+ | USAID
tNames: USAID | GPS | LCD_16x2_I2C | Pressure | Temperature | LORA | AC 140-220V | IUWASH+ | 18650 Battery | USAID